# EasyEDA Pro project 鲲FOC无刷电机控制器.epro, board 驱动板
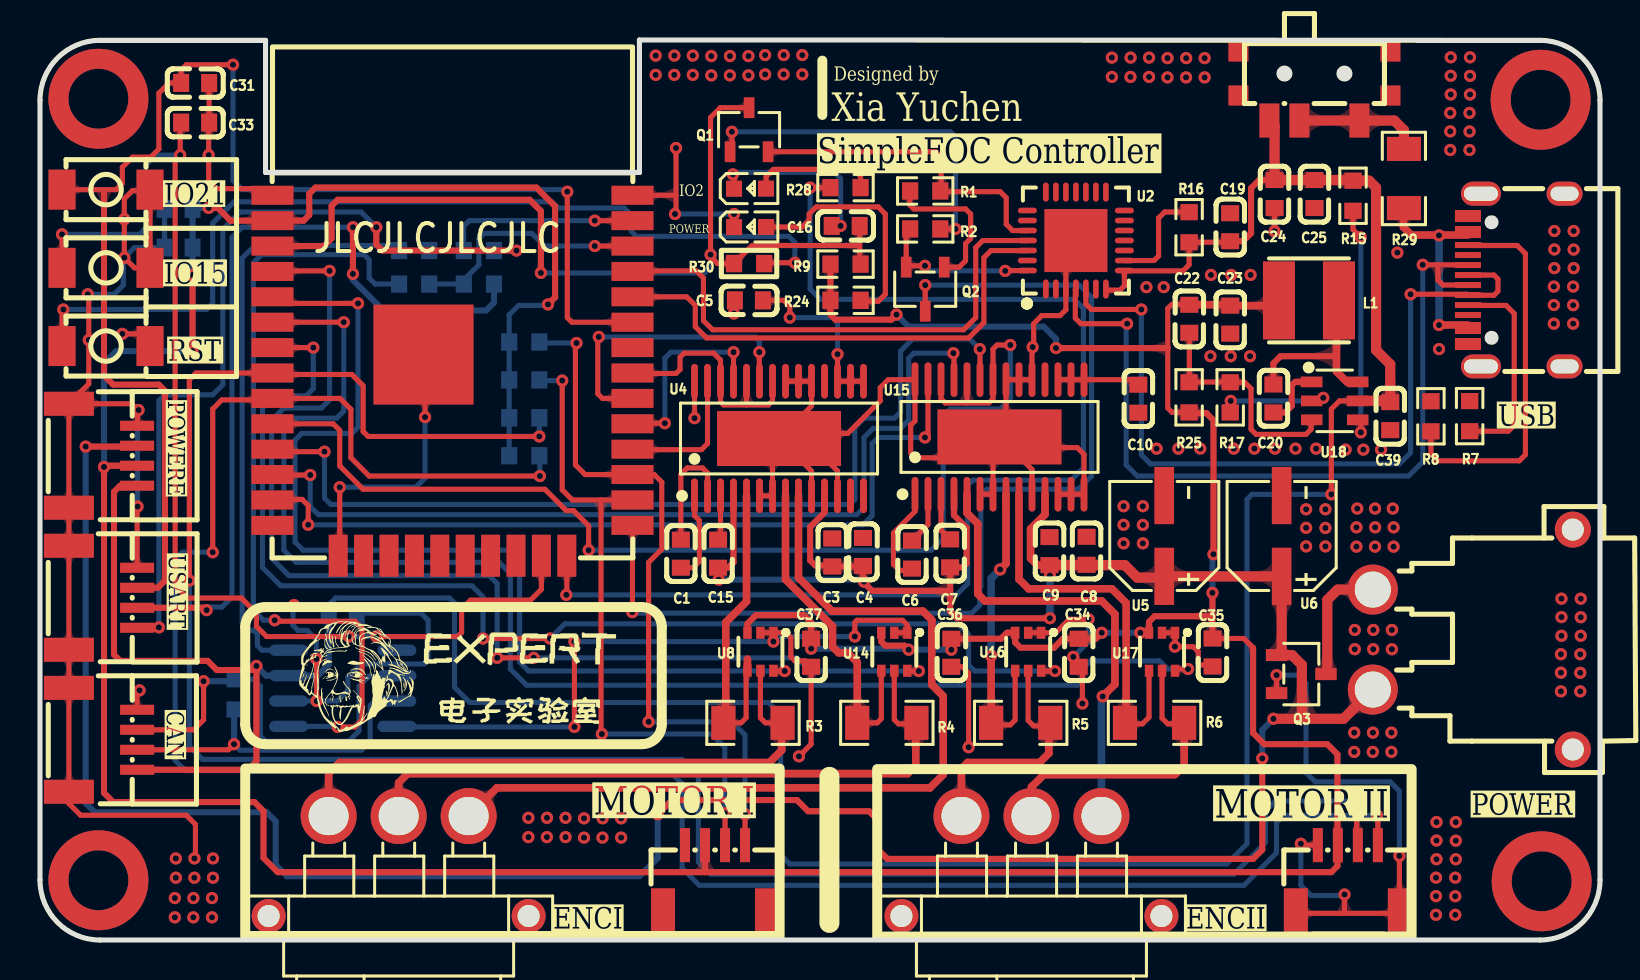
[diagram p2: board, top side]
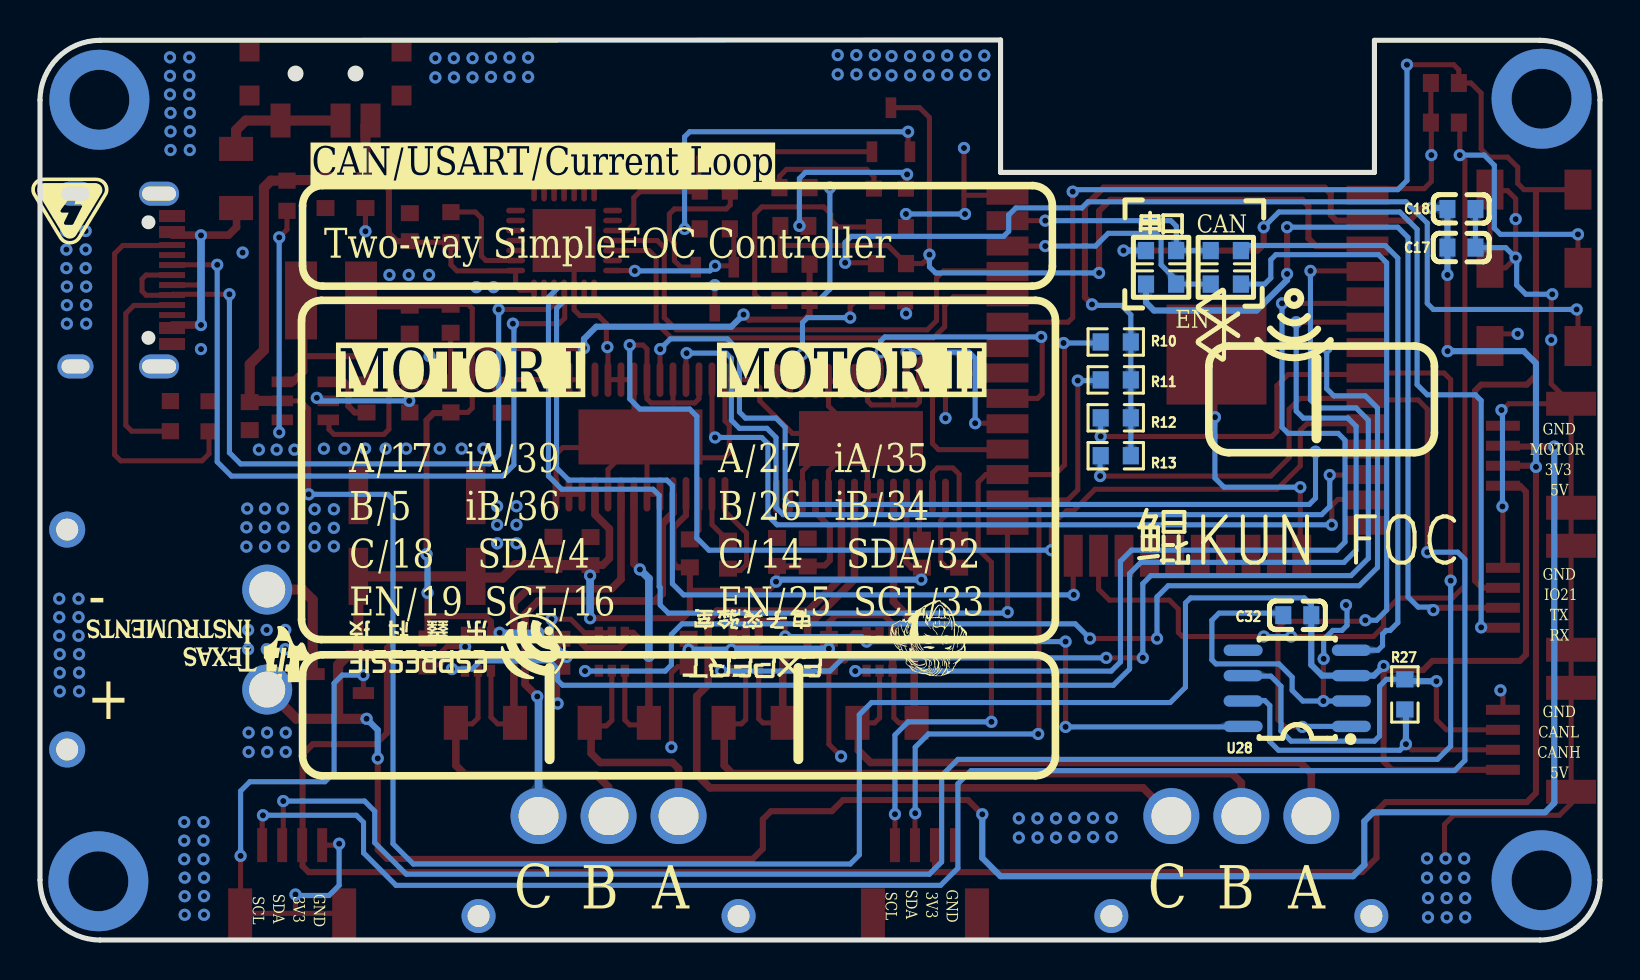
[diagram p3: board, bottom side, seen from below]

Outline 78 x 45.02 mm; copper layers: Top Layer, Bottom Layer. Coordinates in mm from the lower left corner of the outline.
Outline path: 0,42 arc(0.88,44.12) 3,45 11.28,45 11.28,38.39 29.97,38.39 29.97,45.02 75,45 arc(77.12,44.12) 78,42 78,3 arc(77.12,0.88) 75,0 3,0 arc(0.88,0.88) 0,3 0,42
Stack: Top Layer 0.035mm / Dielectric1 1.51mm FR4 er 4.5 / Bottom Layer 0.035mm

## Design rules (mm)
template: 自定义配置
spacing copperThickness1oz (default): track to track 0.102, other pairs 0 to 0.3
spacing copperThickness2oz: track to track 0.203, other pairs 0.152 to 0.3
track width copperThickness1oz (default): min 0.127, default 0.254, max 2.54
track width copperThickness2oz: min 0.203, default 0.254, max 2.54
differential pair differentialPair (default): width min 0.127, default 0.254, max 2.54; gap min 0.152, default 0.152
via viaSize (default): diameter min 0.5, default 0.61, max 10; hole min 0.3, default 0.305, max 6.3

## Placement (name value [footprint] x y rotation side)
C1  0.01UF  [C0603]  32.04 19.32 270 top
C3  10UF  [C0603]  39.61 19.38 90 top
C4  0.1UF  [C0603]  41.15 19.41 270 top
C5  0.1UF  [C0603]  35.45 32 180 top
C6  0.01UF  [C0603]  43.6 19.28 270 top
C7  0.1UF  [C0603]  45.51 19.34 270 top
C8  10UF  [C0603]  52.33 19.47 90 top
C9  0.1UF  [C0603]  50.47 19.45 270 top
C10  0.1UF  [C0603]  54.91 27.08 270 top
C15  0.1UF  [C0603]  33.91 19.32 270 top
C16  10UF  [C0603]  40.28 35.72 0 top
C17  0.01UF  [C0603]  6.93 34.63 180 bottom
C18  0.01UF  [C0603]  6.93 36.57 180 bottom
C19  0.1UF  [C0603]  59.51 35.65 270 top
C20  0.1uf  [C0603]  61.67 27.09 270 top
C22  47pf  [C0603]  57.47 31.07 90 top
C23  10uf  [C0603]  59.51 31.03 90 top
C24  10uf  [C0603]  61.73 37.31 90 top
C25  0.1uf  [C0603]  63.72 37.31 90 top
C31  0.1uf  [C0603]  7.76 42.87 180 top
C32  0.1UF  [C0603]  15.14 16.25 0 bottom
C33  0.1uf  [C0603]  7.76 40.89 180 top
C34  0.1uf  [C0603]  51.93 14.37 270 top
C35  0.1uf  [C0603]  58.63 14.38 90 top
C36  0.1uf  [C0603]  45.57 14.37 270 top
C37  0.1uf  [C0603]  38.56 14.37 270 top
C39  0.1uf  [C0603]  67.51 26.2 90 top
CN1  MR30PW-F  [CONN-TH_MR30PW-F]  17.93 3.7 0 top
CN2  MR30PW-F  [CONN-TH_MR30PW-F]  49.57 3.7 0 top
CN3  XT30PW-M  [CONN-TH_XT30PW-M]  71.64 15.03 90 top
L1  4.7uH  [IND-SMD_L4.0-W4.0_FNR40XXS]  63.45 31.99 180 top
LED1  -  [LED_0603]  35.55 35.67 0 top
LED2  -  [LED_0603]  35.55 37.59 0 top
Q1  S8050 J3Y  [SOT-23-3_L3.0-W1.7-P0.95-LS2.9-BR]  35.45 40.53 270 top
Q2  S8050 J3Y  [SOT-23-3_L3.0-W1.7-P0.95-LS2.9-BR]  44.26 32.55 90 top
Q3  AO3400A  [SOT-23-3_L2.9-W1.6-P1.90-LS2.8-BR]  63.06 13.3 180 top
R1  10K  [R0603]  44.26 37.47 180 top
R2  10K  [R0603]  44.26 35.57 0 top
R3  0.5  [R1206]  35.65 10.86 180 top
R4  0.5  [R1206]  42.34 10.86 180 top
R5  0.5  [R1206]  49.03 10.86 180 top
R6  0.5  [R1206]  55.73 10.86 180 top
R7  5.1K  [R0603]  71.48 26.2 90 top
R8  5.1K  [R0603]  69.55 26.2 90 top
R9  10K  [R0603]  40.28 33.81 0 top
R10  10K  [R0603]  24.21 29.91 0 bottom
R11  10K  [R0603]  24.21 28.02 0 bottom
R12  10K  [R0603]  24.21 26.12 0 bottom
R13  10K  [R0603]  24.21 24.22 0 bottom
R15  100K  [R0603]  65.65 37.23 90 top
R16  210K  [R0603]  57.46 35.65 90 top
R17  22.1k  [R0603]  59.51 27.14 90 top
R24  1K  [R0603]  40.28 32 180 top
R25  100K  [R0603]  57.46 27.14 270 top
R27  120  [R0603]  9.76 12.28 270 bottom
R28  10k  [R0603]  40.28 37.63 0 top
R29  0.5  [R1206]  68.19 38.09 90 top
R30  10  [R0603]  35.45 33.84 0 top
R31  opt(串口)  [R0603]  21.95 34.48 180 bottom
R32  opt（串口）  [R0603]  21.95 32.81 180 bottom
R33  opt(can)  [R0603]  18.71 34.48 180 bottom
R34  opt（can）  [R0603]  18.71 32.81 180 bottom
SW1  MK-12C01-G1.5  [SW-SMD_DEALON_MK-12C01-G1.5]  63.72 42.71 180 top
U1  ESP32-WROOM-32D  [WIFIM-SMD_ESP32-WROOM-32D]  20.62 28.24 270 top
U2  CP2102  [QFN-28_L5.0-W5.0-P0.50-TL-EP3.2]  51.79 34.99 90 top
U4  DRV8313PWPR  [HTSSOP-28_L9.8-W4.5-P0.65-LS6.6-BL-EP]  36.95 25.08 0 top
U5  47uF  [cap-smd_bd5.0-l5.3-w5.3-ls5.7-fd]  56.21 20.21 90 top
U6  47uF  [cap-smd_bd5.0-l5.3-w5.3-ls5.7-fd]  62.08 20.21 90 top
U8  INA199A1DCKR  [SC-70-6_L2.0-W1.3-P0.65-LS2.1-BR]  36.02 14.42 90 top
U11  TC-S3403-2.0-260G  [SW-SMD_L4.0-W3.0-LS5.0]  3.3 37.53 0 top
U14  INA199A1DCKR  [SC-70-6_L2.0-W1.3-P0.65-LS2.1-BR]  42.71 14.42 90 top
U15  DRV8313PWPR  [HTSSOP-28_L9.8-W4.5-P0.65-LS6.6-BL-EP]  47.98 25.16 0 top
U16  INA199A1DCKR  [SC-70-6_L2.0-W1.3-P0.65-LS2.1-BR]  49.41 14.42 90 top
U17  INA199A1DCKR  [SC-70-6_L2.0-W1.3-P0.65-LS2.1-BR]  56.1 14.42 90 top
U18  SY8120B  [SOT-23-6_L2.9-W1.6-P0.95-LS2.8-BL]  64.74 26.97 270 top
U20  SH1.0-4P  [CONN-SMD_4P-P1.00_SH1.0-4P]  33.75 3.04 0 top
U21  SH1.0-4P  [CONN-SMD_4P-P1.00_SH1.0-4P]  65.39 3.04 0 top
U22  SH1.0-4P  [CONN-SMD_4P-P1.00_SH1.0-4P]  3.15 17.12 270 top
U27  SH1.0-4P  [CONN-SMD_4P-P1.00_SH1.0-4P]  3.15 10.01 270 top
U28  TJA1050T/CM,118  [SOIC-8_L5.0-W4.0-P1.27-LS6.0-BL]  15.14 12.59 90 bottom
U29  SH1.0-4P  [CONN-SMD_4P-P1.00_SH1.0-4P]  3.15 24.22 270 top
U30  TC-S3403-2.0-260G  [SW-SMD_L4.0-W3.0-LS5.0]  3.3 33.62 0 top
U31  TC-S3403-2.0-260G  [SW-SMD_L4.0-W3.0-LS5.0]  3.3 29.71 0 top
USB1  HC-TYPE-C-16P-01B  [USB-C-SMD_KH-TYPE-C-16P]  73.81 33.01 90 top

## Footprints (pads in the part's own frame, mm; a bottom-side part is the same pattern mirrored in y, then rotated)
C0603
  rect 0.8x0.9 smd: 1(-0.7,0) 2(0.7,0)
cap-smd_bd5.0-l5.3-w5.3-ls5.7-fd
  rect 2.86x0.98 smd: 1(-2.02,0) 2(2.02,0)
CONN-SMD_4P-P1.00_SH1.0-4P
  rect 0.5x1.7 smd: 1(-1.5,1.705) 2(-0.5,1.705) 3(0.5,1.705) 4(1.5,1.705)
  rect 1.2x2.5 smd: 5(-2.6,-1.705) 6(2.6,-1.705)
CONN-TH_MR30PW-F
  round 2.8 hole 1.995x1.9: 1(-3.5,2.5) 2(0,2.5) 3(3.5,2.5)
  round 1.7 hole 1.1: 4(6.5,-2.5) 5(-6.5,-2.5)
CONN-TH_XT30PW-M
  round 2.5 hole 1.8: 1(-2.5,5) 2(2.5,5)
  round 1.8 hole 1.1: 3(5.5,-5) 4(-5.5,-5)
HTSSOP-28_L9.8-W4.5-P0.65-LS6.6-BL-EP
  oval 0.343x1.732 smd: 1(-4.225,-2.866) 2(-3.575,-2.866) 3(-2.925,-2.866) 4(-2.275,-2.866) 5(-1.625,-2.866) 6(-0.975,-2.866) 7(-0.325,-2.866) 8(0.325,-2.866) 9(0.975,-2.866) 10(1.625,-2.866) 11(2.275,-2.866) 12(2.925,-2.866) 13(3.575,-2.866) 14(4.225,-2.866) 15(4.225,2.866) 16(3.575,2.866) 17(2.925,2.866) 18(2.275,2.866) 19(1.625,2.866) 20(0.975,2.866) 21(0.325,2.866) 22(-0.325,2.866) 23(-0.975,2.866) 24(-1.625,2.866) 25(-2.275,2.866) 26(-2.925,2.866) 27(-3.575,2.866) 28(-4.225,2.866)
  rect 6.2x2.75 smd: 29(0,0)
IND-SMD_L4.0-W4.0_FNR40XXS
  rect 1.6x3.9 smd: 1(-1.5,0) 2(1.5,0)
LED_0603
  rect 0.8x0.8 smd: 1(-0.851,-0.01) 2(0.75,-0.005)
QFN-28_L5.0-W5.0-P0.50-TL-EP3.2
  oval 0.95x0.28 smd: 1(-2.425,1.502) 2(-2.425,1.001) 3(-2.425,0.5) 4(-2.425,0) 5(-2.425,-0.5) 6(-2.425,-1) 7(-2.425,-1.501) 15(2.425,-1.501) 16(2.425,-1) 17(2.425,-0.5) 18(2.425,0) 19(2.425,0.5) 20(2.425,1.001) 21(2.425,1.502)
  oval 0.28x0.95 smd: 8(-1.502,-2.425) 9(-1.001,-2.425) 10(-0.5,-2.425) 11(0,-2.425) 12(0.5,-2.425) 13(1,-2.425) 14(1.501,-2.425) 22(1.501,2.425) 23(1,2.425) 24(0.5,2.425) 25(0,2.425) 26(-0.5,2.425) 27(-1.001,2.425) 28(-1.502,2.425)
  rect 3.15x3.15 smd: 29(0,0)
R0603
  rect 0.806x0.864 smd: 1(-0.753,0) 2(0.753,0)
R1206
  rect 1.208x1.701 smd: 1(-1.479,0) 2(1.479,0)
SC-70-6_L2.0-W1.3-P0.65-LS2.1-BR
  rect 0.6x0.42 smd: 1(0.95,-0.65) 2(0.95,0) 3(0.95,0.65) 4(-0.95,0.65) 5(-0.95,0) 6(-0.95,-0.65)
SOIC-8_L5.0-W4.0-P1.27-LS6.0-BL
  oval 0.569x1.95 smd: 1(-1.905,-2.705) 2(-0.635,-2.705) 3(0.635,-2.705) 4(1.905,-2.705) 5(1.905,2.705) 6(0.635,2.705) 7(-0.635,2.705) 8(-1.905,2.705)
SOT-23-3_L2.9-W1.6-P1.90-LS2.8-BR
  rect 1.07x0.6 smd: 1(1.235,-0.95) 2(1.235,0.95) 3(-1.235,0)
SOT-23-3_L3.0-W1.7-P0.95-LS2.9-BR
  rect 1.038x0.532 smd: 1(1.101,-0.95) 2(1.101,0.95) 3(-1.101,0)
SOT-23-6_L2.9-W1.6-P0.95-LS2.8-BL
  rect 0.532x1.072 smd: 1(-0.95,-1.149) 2(0,-1.149) 3(0.95,-1.149) 4(0.95,1.149) 5(0,1.149) 6(-0.95,1.149)
SW-SMD_DEALON_MK-12C01-G1.5
  rect 1x1.7 smd: 1(2.25,1.725) 2(0.75,1.725) 3(-2.25,1.725)
  rect 1x1 smd: 4(-3.8,0.475) 4(-3.8,-1.725) 4(3.8,0.475) 4(3.8,-1.725)
SW-SMD_L4.0-W3.0-LS5.0
  rect 1.35x2 smd: 1(-2.2,0) 2(2.2,0)
USB-C-SMD_KH-TYPE-C-16P
  oval 1.2x2 hole 0.7x1.7: 1(-4.32,1.765) 2(4.32,1.765)
  oval 1.2x1.8 hole 0.7x1.4: 3(-4.32,-2.415) 4(4.32,-2.415)
  rect 0.3x1.3 smd: A1(-3.35,2.415) A4(-2.55,2.415) A5(-1.25,2.415) A6(-0.25,2.415) A7(0.25,2.415) A8(1.25,2.415) A9(2.55,2.415) A12(3.35,2.415) B1(3.05,2.415) B4(2.25,2.415) B5(1.75,2.415) B6(0.75,2.415) B7(-0.75,2.415) B8(-1.75,2.415) B9(-2.25,2.415) B12(-3.05,2.415)
WIFIM-SMD_ESP32-WROOM-32D
  rect 0.95x2.1 smd: 1(-9.015,-9) 2(-7.745,-9) 3(-6.475,-9) 4(-5.205,-9) 5(-3.935,-9) 6(-2.665,-9) 7(-1.395,-9) 8(-0.125,-9) 9(1.145,-9) 10(2.415,-9) 11(3.685,-9) 12(4.955,-9) 13(6.225,-9) 14(7.495,-9) 25(7.495,9) 26(6.225,9) 27(4.955,9) 28(3.685,9) 29(2.415,9) 30(1.145,9) 31(-0.125,9) 32(-1.395,9) 33(-2.665,9) 34(-3.935,9) 35(-5.205,9) 36(-6.475,9) 37(-7.745,9) 38(-9.015,9)
  rect 2.1x0.95 smd: 15(9.015,-5.715) 16(9.015,-4.445) 17(9.015,-3.175) 18(9.015,-1.905) 19(9.015,-0.635) 20(9.015,0.635) 21(9.015,1.905) 22(9.015,3.175) 23(9.015,4.445) 24(9.015,5.715)
  rect 5x5 smd: 39(-1.045,-1.45)

## Nets
As in the schematic.

Pads without a net: U1 14 16 17 18 19 20 21 22 32; U2 1 2 6 10 11 12 13 14 15 16 17 18 19 20 21 22 23 27; U4 18; U15 18; U28 5; USB1 A8 B8

## Via types
v1: diameter 5, hole 3, Top Layer to Bottom Layer, 4 vias
v2: diameter 0.61, hole 0.305, Top Layer to Bottom Layer, 298 vias

## Routing (per net, layer and track width the routed paths; a pad name or vN(x,y) marks a point on that pad's centre or on a via; arc(x,y) is an arc through that point)
GND: length 284.1
  Top Layer w0.254: v2(64.16,27.12) 64.01,26.97 U18.2 ; v2(37.95,9.19) 38.56,9.8 C37.2 38.26,13.96 37.74,13.96 37.54,14.16 37.54,15.13 37.3,15.37 U8.1 ; v2(52.12,11.83) 52.12,13.48 C34.2 51.93,13.89 v2(51.66,14.16) ; U21.1 63.12,4.74 v2(63.04,4.82) ; U15.6 U15.7 47.65,24.84 ; 34.7,35.66 v2(34.7,36.31) ; 8.46,42.87 8.46,40.89 8.43,40.86 v2(8.43,39.26) 8.43,37.94 8.79,37.58 11.29,37.58 U1.1 ; R17.1 59.54,26.42 v2(59.54,26.97) ; U17.2 U17.1 56.75,14.68 v2(56.74,14.67) 57.66,14.67 57.91,14.42 57.91,13.86 58.01,13.76 58.55,13.76 C35.1 ; U4.21 U4.20 U4.19 38.58,26.71 37.21,25.34 ; U1.39 19.25,29.2 v2(19.25,26.15) ; C16.1 v2(40.03,35.72) ; U15.29 48.3,25.49 U15.21 U15.20 U15.19 49.6,29.63 v2(49.63,29.66) 49.68,29.71 49.68,30.83 50.09,31.23 51,31.23 51.29,31.52 51.29,34.49 U2.29 ; U15.29 48.51,24.63 ; U15.29 47.65,24.84 ; U4.12 39.88,23.46 38.25,25.08 U4.29 ; v2(40.74,15.18) 40.74,15.89 40.84,15.99 43.13,15.99 43.36,15.76 U14.1 U14.2 ; 34.7,37.58 34.7,38.24 v2(34.65,38.29) ; U29.5 U22.5 U22.6 U27.5 U27.6 1.44,6.83 2.03,6.24 7.31,6.24 7.77,5.78 7.77,4.13 v2(7.72,4.08) ; U29.5 2.44,27.82 v2(2.44,30.01) 2.44,32.25 v2(2.39,32.3) ; U29.5 4.56,26.82 4.88,26.51 ; U4.29 37.21,25.34 ; U4.29 37.45,24.58 38.58,23.46 U4.10 ; U4.29 36.63,24.76 U4.7 U4.6 ; 31.8,37.25 U1.38 ; 31.8,37.25 v2(31.8,39.61) ; 31.8,37.25 31.8,36.36 v2(31.75,36.31) ; U8.2 U8.1 ; U8.1 v2(36.67,14.93) ; v2(4.93,26.51) 4.88,26.51 ; 4.88,26.51 4.88,25.75 U29.1 ; 37.21,25.34 40.39,25.34 42.01,26.97 42.01,27.63 42.41,28.03 U15.28 43.75,25.96 43.54,25.75 43.54,24.38 43.79,24.12 46.93,24.12 47.48,24.66 47.65,24.84 ; v2(26.72,14.93) v2(26.72,10.66) ; U22.1 4.85,21.66 v2(4.88,21.68) ; v2(46.43,9.64) 46.43,13.35 46.12,13.67 C36.2 ; U27.1 4.85,12.36 v2(4.98,12.49) ; C5.2 34.75,31.38 v2(34.7,31.33) ; v2(13.82,14.06) 13.83,14.05 v2(13.83,11.95) ; U15.12 U15.13 U15.14 52.2,24.3 51.87,24.63 48.51,24.63 ; 48.51,24.63 49.6,23.54 U15.10 ; U31.2 4.89,30.32 v2(4.11,30.32) ; v2(67.97,4.21) 67.97,1.36 U21.6 65.17,1.33 ; 65.17,1.33 U21.5 ; 65.17,1.33 65.23,1.4 v2(65.23,2.28) ; U1.15 14.99,19.3 v2(14.99,22.65) ; C24.1 v2(61.73,35.45) ; U4.28 v2(32.73,26.1) ; U16.2 U16.1 50.78,15.37 51.46,16.04 v2(52.43,16.04) ; Q3.2 v2(61.83,13.25) ; U11.2 5.45,37.48 4.62,37.48 4.22,37.08 v2(4.22,36.06) v2(4.22,34.13) 4.72,33.62 U30.2 U11.2
  Bottom Layer w0.254: C18.2 C17.2 4.72,34.63 v2(4.22,34.13) 4.17,34.08 4.17,32.76 3.71,32.3 v2(2.39,32.3) ; C32.2 15.94,16.35 19.05,16.35 19.41,15.99 19.41,14.01 19.2,13.81 16.05,13.81 15.39,13.15 15.39,12.49 14.86,11.95 v2(13.83,11.95) U28.2 ; v2(31.75,36.31) v2(34.7,36.31) ; v2(4.93,26.51) 4.88,26.46 v2(4.88,21.68) ; v2(19.25,26.15) 19.25,23.11 18.8,22.65 v2(14.99,22.65) ; v2(67.97,4.21) 67.97,7.45 67.51,7.92 63.75,7.92 63.3,8.37 63.3,12.84 62.89,13.25 v2(61.83,13.25) ; v2(13.82,14.06) 13.82,15.03 13.36,15.48 12.9,15.48 12.65,15.74 12.65,16.7 v2(12.7,16.75) ; v2(51.66,14.16) 52.43,14.93 v2(52.43,16.04) ; v2(64.16,27.12) 64.01,26.97 v2(59.54,26.97) 59.54,27.02 ; v2(40.03,35.72) 40.03,38.09 39.73,38.4 34.75,38.4 v2(34.65,38.29) ; v2(26.72,10.66) 17.87,10.66 U28.8 ; v2(26.72,14.93) v2(36.67,14.93) 36.93,15.18 v2(40.74,15.18) ; v2(65.23,2.28) 65.18,2.23 63.55,2.23 63.04,2.73 v2(63.04,4.82)
  vias: v2(6.74,2.1) v2(6.74,1.13) v2(6.79,4.08) v2(6.79,3.12) v2(7.72,3.12) v2(7.67,2.1) v2(7.67,1.13) v2(8.6,2.1) v2(8.6,1.13) v2(8.65,4.08) v2(8.65,3.12) v2(24.42,6.11) v2(24.42,5.15) v2(25.35,6.11) v2(25.34,5.15) v2(26.28,6.11) v2(26.28,5.15) v2(27.2,6.09) v2(27.2,5.12) v2(28.13,6.09) v2(28.12,5.12) v2(29.06,6.09) v2(29.06,5.12) v2(30.78,44.24) v2(30.78,43.27) v2(31.72,44.24) v2(31.71,43.27) v2(32.64,44.24) v2(32.64,43.27) v2(33.56,44.21) v2(33.56,43.25) v2(34.5,44.21) v2(34.49,43.25) v2(35.42,44.21) v2(35.42,43.25) v2(36.26,44.26) v2(36.26,43.3) v2(37.19,44.26) v2(37.18,43.3) v2(38.11,44.26) v2(38.11,43.3) v2(53.59,44.14) v2(53.59,43.17) v2(54.18,21.7) v2(54.18,20.77) v2(54.18,19.84) v2(54.53,44.14) v2(54.52,43.17) v2(55.14,21.7) v2(55.14,20.76) v2(55.14,19.84) v2(55.32,32.66) v2(55.45,44.14) v2(55.45,43.17) v2(55.83,24.58) v2(56.19,32.66) v2(56.37,44.11) v2(56.37,43.15) v2(56.92,24.58) v2(57.31,44.11) v2(57.3,43.15) v2(58.01,24.58) v2(58.23,44.11) v2(58.23,43.15) v2(58.55,33.27) v2(58.52,29.2) v2(59.54,29.2) v2(59.56,33.27) v2(59.69,24.58) v2(60.53,33.27) v2(60.5,29.2) v2(60.72,24.58) v2(61.75,24.58) v2(62.78,24.58) v2(63.31,21.54) v2(63.31,20.62) v2(63.31,19.69) v2(63.81,24.58) v2(64.27,21.54) v2(64.27,20.61) v2(64.27,19.69) v2(65.28,24.53) v2(65.74,15.51) v2(65.74,14.55) v2(65.71,10.37) v2(65.71,9.41) v2(65.82,20.64) v2(65.82,19.68) v2(65.86,21.58) v2(66.17,24.53) v2(66.65,10.37) v2(66.64,9.41) v2(66.67,15.51) v2(66.66,14.55) v2(66.75,21.58) v2(66.76,20.64) v2(66.75,19.68) v2(67.06,24.53) v2(67.64,21.58) v2(67.59,15.51) v2(67.59,14.55) v2(67.57,10.37) v2(67.57,9.41) v2(67.68,20.64) v2(67.68,19.68) v2(67.87,34.38) v2(69.82,5.9) v2(69.82,4.97) v2(69.82,4.04) v2(69.8,3.12) v2(69.8,2.2) v2(69.8,1.26) v2(69.95,29.56) v2(70.54,44.15) v2(70.54,43.23) v2(70.54,42.29) v2(70.51,41.37) v2(70.51,40.45) v2(70.51,39.51) v2(70.79,5.9) v2(70.79,4.97) v2(70.79,4.04) v2(70.76,3.12) v2(70.76,2.19) v2(70.76,1.26) v2(71.5,44.15) v2(71.5,43.22) v2(71.5,42.29) v2(71.48,41.37) v2(71.48,40.44) v2(71.48,39.51) v2(75.72,35.46) v2(75.72,34.54) v2(75.72,33.61) v2(75.69,32.68) v2(75.69,31.76) v2(75.69,30.83) v2(76.05,14.29) v2(76.05,13.37) v2(76.05,12.44) v2(76.07,17.07) v2(76.07,16.15) v2(76.07,15.22) v2(76.68,35.46) v2(76.68,34.53) v2(76.68,33.61) v2(76.66,32.68) v2(76.66,31.76) v2(76.66,30.83) v2(77.04,17.07) v2(77.04,16.15) v2(77.04,15.22) v2(77.01,14.29) v2(77.01,13.37) v2(77.01,12.44)
VCC-3V3: length 226.7
  Top Layer w0.254: C35.2 60.19,15.08 60.66,14.62 ; C22.2 57.45,31.79 56.59,31.79 56.39,31.59 56.39,26.61 56.61,26.39 R25.2
  Top Layer w0.305: v2(7.62,29.45) 7.63,29.46 v2(7.63,33.27) ; 33.25,3.39 64.57,3.39 64.87,3.7 64.87,4.72 U21.2 64.87,4.76 64.87,9.29 64.36,9.8 61.21,9.8 60.66,10.35 60.66,14.62 ; 33.25,3.39 U20.2 ; 33.25,3.39 11.89,3.39 11.18,4.11 11.18,6.44 10.72,6.9 3.66,6.9 3.2,7.36 v2(3.2,23.66) 3.2,23.72 3.19,23.72 U29.3 ; 35.37,15.37 35.37,15.82 35.8,16.25 38.2,16.25 38.56,15.89 C37.1 v2(38.56,14.57) ; 58.62,16.2 55.73,16.2 55.45,15.92 U17.3 v2(55.02,15.37) ; 58.62,16.2 v2(58.62,17.36) ; 58.62,16.2 58.62,15.09 C35.2 ; v2(53.09,15.37) 52.79,15.07 C34.1 51.14,15.07 50.7,14.62 49.02,14.62 48.76,14.89 U16.3 48.35,15.37 48.05,15.07 C36.1 v2(45.57,14.52) ; v2(42.82,31.28) 42.57,31.03 39.78,31.03 39.52,31.28 R24.2 R9.1 ; U14.3 42.06,14.92 42.27,14.72 43.23,14.72 v2(43.43,14.52) ; R25.2 57.49,26.36 58.32,26.36 58.67,26 v2(58.67,19.3) ; v2(50.8,29.61) 56.39,29.61 ; v2(8.43,36.62) 8.89,36.62 9.53,35.98 13.18,35.98 13.46,36.26 13.46,37.33 13.77,37.63 24.82,37.63 25.76,36.7 25.76,32.15 v2(25.4,31.79)
  Top Layer w0.381: L1.2 61.69,31.73 C23.2 59.47,31.77 C22.2
  Bottom Layer w0.254: R13.1 R12.1 R11.1 R10.1 23.46,31.27 23.93,31.74 25.35,31.74 v2(25.4,31.79)
  Bottom Layer w0.305: v2(45.57,14.52) v2(43.43,14.52) 43.38,14.57 v2(38.56,14.57) ; v2(58.67,19.3) 58.62,19.24 v2(58.62,17.36) ; v2(3.2,23.66) 3.2,28.85 3.81,29.45 v2(7.62,29.45) ; v2(7.63,33.27) C17.1 C18.1 7.68,36.62 v2(8.43,36.62) ; v2(50.8,29.61) 50.8,30.06 50.19,30.67 43.43,30.67 v2(42.82,31.28) ; v2(55.02,15.37) v2(53.09,15.37)
VCC-MOTOR: length 162.7
  Top Layer w0.305: 45.51,17.47 45.51,16.43 45.85,16.09 v2(50.5,16.09) ; 45.51,17.47 C7.2 46.13,18.64 46.33,18.84 46.33,20.62 45.7,21.25 U15.4 ; 45.51,17.47 41.6,17.47 41.15,17.92 ; v2(41.2,17.92) 41.15,17.92 ; 41.15,17.92 C4.2 41.12,18.68 C3.1 39.56,18.74 38.76,18.74 38.51,18.99 38.51,20.67 39.23,21.39 U4.11 ; U29.2 4.81,24.68 v2(2.29,24.68) ; v2(61.11,9.08) 61.11,4.51 60.66,4.06 42.37,4.06 41.86,4.56 41.86,6.04 41.45,6.44 38.41,6.44 37.85,7 31.6,7 v2(30.89,6.29) ; U4.4 34.68,18.89 34.41,18.62 C15.2 33.91,18.05 v2(33.93,18.03)
  Top Layer w0.381: U15.11 50.25,21.29 49.53,20.56 49.53,19.09 49.87,18.75 C9.2 50.47,18.25 v2(50.5,18.23)
  Top Layer w0.508: C9.2 52.31,18.75 ; 52.31,18.75 54.24,18.75 54.86,18.13 56.15,18.13 U5.1 U6.1 62.08,14.5 Q3.1 62.6,14.25 63.09,13.76 63.09,11.07 ; 52.31,18.75 C8.1 ; CN3.1 65.18,11.07 63.09,11.07 ; v2(61.67,11.07) 63.09,11.07
  Bottom Layer w0.305: v2(61.67,11.07) 61.11,10.51 v2(61.11,9.08) ; v2(2.29,24.68) 2.29,6.85 2.74,6.39 11.33,6.39 11.79,5.94 11.79,3.75 12.34,3.19 29.97,3.19 30.89,4.11 v2(30.89,6.29) ; v2(41.2,17.92) 41.1,18.03 v2(33.93,18.03)
  Bottom Layer w0.381: v2(50.5,16.09) v2(50.5,18.23)
(no net):
  vias: v1(2.92,42.08) v1(2.92,2.99) v1(75.03,42.03) v1(75.08,2.94)
BOOTMODE: length 52.2
  Top Layer w0.254: Q2.3 v2(44.26,32.76) ; v2(29.62,16.4) 29.62,16.41 U1.25
  Bottom Layer w0.254: v2(29.62,16.4) 29.67,16.35 46.58,16.35 46.99,16.75 46.99,17.64 47.04,17.67 47.04,22.24 47.35,22.55 51.92,22.55 52.58,23.21 52.58,32.15 51.97,32.76 v2(44.26,32.76)
CAN_RX: length 29.7
  Bottom Layer w0.254: 17.95,34.48 17.7,34.74 10.74,34.74 10.11,34.11 10.11,15.87 10.5,15.48 10.69,15.48 10.87,15.3 10.87,14.72 11.1,14.49 U28.4
CAN_TX: length 40.2
  Top Layer w0.254: v2(14.88,10.66) 15.75,10.66 16.1,11.02 16.1,15.59 15.75,15.94 11.79,15.94 v2(11.73,15.99)
  Bottom Layer w0.254: v2(14.88,10.66) 14.86,10.68 U28.1 ; 17.95,32.81 16.76,32.81 16.46,33.11 16.46,34.03 16.2,34.28 11.07,34.28 10.67,33.88 10.67,16.5 11.18,15.99 v2(11.73,15.99)
CANH: length 17.1
  Top Layer w0.254: U27.3 9.42,9.51 v2(9.7,9.8)
  Bottom Layer w0.254: v2(9.7,9.8) 10.01,9.49 16.07,9.49 16.51,9.93 16.51,11.73 16.76,11.98 17.82,11.98 U28.7
  Bottom Layer w0.305: R27.2 9.7,11.48 v2(9.7,9.8)
CANL: length 20.6
  Top Layer w0.254: U27.2 7.68,10.51 8.18,11.02 v2(8.18,12.94)
  Bottom Layer w0.254: U28.6 17.82,13.2 16.46,13.2 15.95,12.69 15.95,10.46 15.44,9.95 11.28,9.95 11.02,10.2 11.02,12.69 10.68,13.04 R27.1
  Bottom Layer w0.305: R27.1 9.66,12.94 v2(8.18,12.94)
CC1: length 10.4
  Top Layer w0.254: R7.1 73.41,25.45 73.71,25.75 73.71,31.33 73.3,31.74 71.42,31.74 71.4,31.76
CC2: length 19.2
  Top Layer w0.254: 71.4,34.76 71.42,34.74 73.86,34.74 74.27,34.33 74.27,24.27 73.97,23.97 69.9,23.97 69.55,24.32 R8.1
CP-RX: length 26.1
  Top Layer w0.254: U1.35 29.65,33.47 32.82,33.47 33.17,33.11 33.17,30.98 33.63,30.52 46.18,30.52 46.79,31.13 46.79,34.64 47.14,34.99 U2.25
CP-TX: length 24.9
  Top Layer w0.254: 49.37,34.48 47.55,34.48 47.19,34.13 47.19,30.88 46.43,30.12 33.32,30.12 32.77,30.67 32.77,31.74 32.34,32.17 U1.34
DN: length 39.4
  Top Layer w0.254: v2(68.53,32.3) 71.36,32.3 USB1.B7 71.41,32.25 72.69,32.25 72.9,32.45 72.9,33.06 72.7,33.26 USB1.A7 ; 52.29,32.56 52.29,31.81 52.57,31.54 v2(55.07,31.54)
  Bottom Layer w0.254: v2(55.07,31.54) 55.07,24.27 55.52,23.82 67.97,23.82 68.53,24.38 v2(68.53,32.3)
DP: length 41.1
  Top Layer w0.254: v2(69.14,33.77) 69.9,33.77 ; 69.9,33.77 71.39,33.77 71.4,33.76 ; 69.9,33.77 69.9,33.01 70.15,32.76 71.4,32.76 ; v2(54.36,30.83) 52.04,30.83 51.76,31.11 51.76,32.53 51.79,32.56
  Bottom Layer w0.254: v2(54.36,30.83) 54.31,30.78 54.31,23.77 54.86,23.21 68.43,23.21 69.14,23.92 v2(69.14,33.77)
DTR: length 8.2
  Top Layer w0.254: R2.1 43.31,35.37 Q2.2 43.38,33.72 v2(44.25,33.72) ; v2(48.26,33.47) 48.28,33.48 49.37,33.48
  Bottom Layer w0.254: v2(48.26,33.47) 44.5,33.47 v2(44.25,33.72)
ESPEN: length 46.9
  Top Layer w0.254: Q1.3 34.02,41.63 33.53,41.14 v2(33.53,34.28) 33.53,34.18 33.87,33.84 R30.1 35.6,34.74 40.98,34.74 ; 40.98,34.74 40.98,33.85 R9.2 ; 40.98,34.74 C16.2
  Top Layer w0.305: U1.3 14.2,34.71 14.58,35.09 14.58,36.72 14.88,37.02 24.49,37.02 25.04,36.47 v2(25.04,33.37)
  Bottom Layer w0.254: v2(25.04,33.37) 33.22,33.37 33.53,33.67 v2(33.53,34.28)
IO15: length 57.5
  Top Layer w0.254: U1.23 25.07,17.54 24.53,17 21.53,17 21.08,16.55 21.08,15.38 20.88,15.18 v2(16.81,15.18) ; v2(15.44,15.18) 11.33,15.18 10.82,15.69 10.82,16.35 10.06,17.1 7.38,17.1 6.76,17.72 6.76,39.01 v2(7.01,39.26) 7.01,40.84 C33.2 ; U30.1 v2(1.1,35.3)
  Bottom Layer w0.254: v2(1.1,35.3) 4.98,35.3 5.28,35.6 5.28,38.75 5.79,39.26 v2(7.01,39.26) ; v2(15.44,15.18) v2(16.81,15.18)
IO21: length 69.7
  Top Layer w0.254: 29.62,30.9 26.6,30.9 26.37,31.13 v2(26.37,37.43) ; v2(9.65,43.78) 7.31,43.78 7.06,43.53 7.06,42.87 C31.2 6.45,42.87 5.94,42.36 5.94,39.56 5.54,39.16 4.62,39.16 4.11,38.65 4.11,37.84 3.8,37.53 U11.1
  Top Layer w0.305: U22.2 5.89,17.62 6.25,17.97 6.25,27.47 5.94,27.78 3.66,27.78 3.2,28.24 3.2,37.51
  Bottom Layer w0.254: v2(9.65,43.78) 9.65,37.99 10.11,37.53 26.26,37.53 v2(26.37,37.43)
IO22: length 12.4
  Top Layer w0.254: U1.36 v2(27.74,34.71)
  Bottom Layer w0.254: v2(27.74,34.71) 25.22,34.71 24.59,35.35 22.2,35.35 21.95,35.09 21.95,33.77 21.19,33.02 R32.2 R34.1
IO23: length 11.5
  Top Layer w0.254: 29.62,35.98 v2(27.74,35.98)
  Bottom Layer w0.254: v2(27.74,35.98) 21.46,35.98 21.18,35.7 21.18,34.49 R31.2 R33.1
M1-EN: length 12.3
  Top Layer w0.254: U4.22 36.63,26.97 36.42,26.76 35.33,26.76 ; U1.31 29.65,28.34 31.8,28.34 32,28.54 32,29.15 32.21,29.35 33.68,29.35 34.03,29.01 U4.26 34.03,26.92 34.18,26.76 35.33,26.76 ; 35.33,26.76 U4.24
M1-I2C-SCL: length 35.5
  Top Layer w0.254: v2(30.43,10.91) 30.43,18.89 31.09,19.55 31.09,22.9 30.71,23.28 U1.27 27.26,23.28 26.77,23.77 26.77,29.81 v2(26.82,29.86) ; U20.4 v2(35.25,6.29)
  Bottom Layer w0.254: v2(35.25,6.29) 35.25,10.26 34.59,10.91 v2(30.43,10.91) ; R10.2 25.02,29.86 v2(26.82,29.86)
M1-I2C-SDA: length 33.4
  Top Layer w0.254: U20.3 34.25,6.33 v2(34.24,6.34) ; v2(26.11,27.98) 26.11,22.52 26.62,22.01 28.05,22.01 ; 28.05,22.01 U1.26 ; 28.05,22.01 28.05,10.34 v2(28.09,10.3)
  Bottom Layer w0.254: v2(34.24,6.34) 34.24,9.64 33.58,10.3 v2(28.09,10.3) ; R11.2 25,27.98 v2(26.11,27.98)
M1-ISENS-1: length 49.8
  Top Layer w0.254: v2(37.24,13.45) 36.69,13.45 U8.6 ; v2(15.9,31.84) 11.95,31.84 U1.5
  Bottom Layer w0.254: v2(15.9,31.84) 15.9,25.64 15.6,25.34 13.09,25.34 12.75,25 12.75,19.91 13.16,19.5 23.42,19.5 23.98,18.94 23.98,13.91 24.44,13.45 v2(37.24,13.45)
M1-ISENS-2: length 57
  Top Layer w0.254: v2(14.48,33.47) 11.65,33.47 U1.4 ; U14.6 43.38,13.45 v2(43.94,13.45) ; v2(24.69,14.11) v2(22.86,14.11)
  Bottom Layer w0.254: v2(24.69,14.11) 37.85,14.11 38.51,13.45 v2(43.94,13.45) ; v2(22.86,14.11) 22.86,17.82 22.45,18.23 12.45,18.23 11.58,19.09 11.58,26 12.19,26.61 14.07,26.61 14.48,27.02 v2(14.48,33.47)
M1-PORT-1: length 30.2
  Top Layer w0.254: U8.5 36.02,11.11 36.27,10.86 R3.1
  Top Layer w0.381: CN1.1 14.43,8.33 14.99,8.88 36.47,8.88 37.08,9.49 37.08,10.82 R3.1
M1-PORT-2: length 33.6
  Top Layer w0.254: U14.5 42.71,11.02 42.93,10.81 43.77,10.81 43.79,10.83
  Top Layer w0.381: CN1.2 17.93,7.86 18.39,8.32 43.38,8.32 43.79,8.73 43.79,10.83 43.82,10.86
M1-PORT-3: length 44.2
  Top Layer w0.381: U4.9 37.93,18.13 39.6,16.45 44.15,16.45 44.59,16.01 44.59,12.77 45.16,12.2 45.16,8.27 44.5,7.61 22.84,7.61 CN1.3
M1-PWM-1: length 7
  Top Layer w0.254: U1.28 29.65,24.53 33.07,24.53 33.38,24.83 U4.27
M1-PWM-2: length 9.9
  Top Layer w0.254: U1.29 29.65,25.85 v2(31.24,25.85) ; U4.25 v2(34.68,29.4)
  Bottom Layer w0.254: v2(34.68,29.4) 31.55,29.4 31.24,29.1 v2(31.24,25.85)
M1-PWM-3: length 14.8
  Top Layer w0.254: v2(35.97,29.4) 35.97,27.96 U4.23 ; U1.30 28.12,27.09 27.89,27.32 27.89,30.12 v2(27.94,30.17)
  Bottom Layer w0.254: v2(35.97,29.4) 35.97,29.96 35.76,30.17 v2(27.94,30.17)
M2-EN: length 59
  Top Layer w0.254: 46.31,26.86 47.45,26.86 47.65,27.07 U15.22 47.65,29.56 47.85,29.76 v2(48.51,29.76) ; 46.31,26.86 45.26,26.86 45.05,27.08 U15.26 ; 46.31,26.86 46.35,26.9 U15.24 ; v2(27.43,19.5) 27.43,20.72 26.67,21.48 26.31,21.48 25.24,22.55 16.15,22.55 14.99,23.72 14.99,25.49 14.66,25.82 U1.10
  Bottom Layer w0.254: v2(48.51,29.76) 48.51,27.07 48.01,26.56 45.52,26.56 45.16,26.2 45.16,20.11 44.55,19.5 v2(27.43,19.5)
M2-I2C-SCL: length 108.9
  Top Layer w0.254: U21.4 66.89,6.2 v2(66.85,6.24) ; v2(8.64,19.4) 8.64,26.56 9.09,27.02 11.55,27.02 U1.9 15,27.09 15.55,26.55 15.55,24.12 16.46,23.21 v2(24.99,23.21)
  Bottom Layer w0.254: v2(24.99,23.21) 24.99,24.19 R13.2 ; v2(66.85,6.24) 62.18,6.24 61.82,5.88 61.82,4.36 60.2,2.73 32.97,2.73 32.11,3.6 32.11,7.81 31.44,8.47 7.26,8.47 6.76,8.98 6.76,19.04 7.11,19.4 v2(8.64,19.4)
M2-I2C-SDA: length 107.8
  Top Layer w0.254: v2(24.97,25.19) 16.41,25.19 16.15,25.44 16.15,27.73 15.6,28.29 11.7,28.29 U1.8 7.8,28.36 7.47,28.03 v2(7.47,17.97) ; v2(65.84,6.95) 65.84,4.8 U21.3
  Bottom Layer w0.254: R12.2 v2(24.97,25.19) ; v2(65.84,6.95) 61.77,6.95 61.26,6.44 61.26,4.87 59.69,3.29 33.53,3.29 32.92,3.9 32.92,8.22 32.11,9.03 8.13,9.03 7.47,9.69 v2(7.47,17.97)
M2-ISENS-1: length 60.5
  Top Layer w0.254: v2(50.75,13.45) 50.07,13.45 U16.6 ; U1.7 v2(13.67,29.63) ; v2(25.5,15.08) v2(22.15,15.08)
  Bottom Layer w0.254: v2(13.67,29.63) 13.67,27.58 13.31,27.22 11.73,27.22 11.12,26.61 11.12,18.64 12.04,17.72 21.59,17.72 22.15,17.16 v2(22.15,15.08) ; 50.89,13.45 46.74,13.45 46.43,13.76 46.43,15.28 45.9,15.81 26.24,15.81 v2(25.5,15.08) ; 50.89,13.45 50.87,13.44 50.73,13.44 ; 50.89,13.45 50.9,13.47
M2-ISENS-2: length 70.2
  Top Layer w0.254: 11.62,30.9 v2(15.19,30.9) ; v2(57.4,13.56) 56.84,13.56 U17.6
  Bottom Layer w0.254: v2(15.19,30.9) 15.19,26.46 14.83,26.1 12.6,26.1 12.19,25.7 12.19,19.5 12.8,18.89 22.96,18.89 23.52,18.33 23.52,13.56 24.33,12.74 51.87,12.74 52.12,13 52.12,13.56 52.53,13.96 55.98,13.96 56.39,13.56 v2(57.4,13.56) 57.46,13.61 57.56,13.61
M2-PORT-1: length 12.3
  Top Layer w0.254: U16.5 49.41,10.98 49.68,10.71 50.36,10.71 50.44,10.79
  Top Layer w0.381: R5.1 50.44,10.79 50.44,9.34 49.99,8.88 46.38,8.88 46.07,8.57 CN2.1
M2-PORT-2: length 15.3
  Top Layer w0.254: R6.1 57.16,10.81 56.39,10.81 56.1,11.1 U17.5
  Top Layer w0.381: CN2.2 49.57,7.65 50.19,8.27 56.74,8.27 57.21,8.73 R6.1
M2-PORT-3: length 22.9
  Top Layer w0.381: v2(53.14,12.18) 53.75,12.79 53.75,16.3 53.09,16.96 47.24,16.96 46.89,17.31 46.89,20.82 46.35,21.36 U15.5
  Bottom Layer w0.381: v2(53.14,12.18) 53.07,12.12 CN2.3
M2-PWM-1: length 40.6
  Top Layer w0.254: v2(44.25,25.14) 44.4,25.29 U15.27 ; v2(13.41,20.77) 13.41,21.73 13.11,22.04 11.65,22.04 U1.13
  Bottom Layer w0.254: v2(44.25,25.14) 41.91,25.14 41.6,24.83 41.6,21.23 41.15,20.77 v2(13.41,20.77)
M2-PWM-2: length 44.3
  Top Layer w0.254: v2(13.51,23.26) 11.65,23.26 U1.12 ; v2(45.67,29.35) 45.7,29.32 U15.25
  Bottom Layer w0.254: v2(13.51,23.26) 13.51,21.68 13.92,21.28 40.84,21.28 41.2,21.63 41.2,25.14 41.66,25.59 43.03,25.59 43.43,26 43.43,29.1 43.69,29.35 v2(45.67,29.35)
M2-PWM-3: length 46.9
  Top Layer w0.254: v2(46.99,29.56) 47,29.55 U15.23 ; U1.11 11.75,24.43 v2(14.22,24.43)
  Bottom Layer w0.254: v2(46.99,29.56) 46.48,30.06 43.64,30.06 43.03,29.45 43.03,26.41 42.72,26.1 41.2,26.1 40.74,25.64 40.74,22.04 40.49,21.78 14.54,21.78 14.22,22.1 v2(14.22,24.43)
RTS: length 16.4
  Top Layer w0.254: 49.37,35.49 48.63,35.49 48.31,35.81 48.31,37.13 48.01,37.43 45.05,37.43 R1.1 45.06,37.51 45.06,39.16 44.79,39.43 Q1.2
SERIAL1-RX: length 41.2
  Top Layer w0.305: U22.4 5.92,15.62 v2(5.94,15.64) ; v2(16.81,35.65) 16.81,34.79 17.12,34.48 v2(23.82,34.48)
  Bottom Layer w0.254: v2(16.81,35.65) 16.05,36.42 10.01,36.42 9.14,35.55 9.14,27.78 8.64,27.27 6.23,27.27 5.94,26.99 v2(5.94,15.64)
  Bottom Layer w0.305: R31.1 v2(23.82,34.48)
SERIAL1-TX: length 40.7
  Top Layer w0.305: v2(15.65,35.65) v2(15.65,33.32) ; U22.3 8.21,16.62 v2(8.33,16.5)
  Bottom Layer w0.254: v2(15.65,35.65) 10.11,35.65 9.6,35.14 9.6,17.16 9.09,16.65 8.48,16.65 v2(8.33,16.5)
  Bottom Layer w0.305: v2(15.65,33.32) 15.65,33.01 17.17,31.49 22.3,31.49 22.7,31.89 R32.1
USB-VCC: length 154.9
  Top Layer w0.254: v2(64.57,22.29) 64.57,26.56 64.97,26.97 65.88,26.97 ; C19.2 59.45,34.9 R16.1 57.46,33.77 57.15,33.47 54.24,33.47 ; 54.22,33.48 54.22,32.72 54,32.5 53.35,32.5 53.3,32.56
  Top Layer w0.305: C19.2 60.16,34.95 60.55,35.35 60.55,37.61 60.96,38.01 C24.2 ; U29.4 4,22.72 3.7,22.42 3.7,14.27 4.01,13.96 8.38,13.96 8.84,13.5 10.62,13.5 v2(10.82,13.71) 10.82,8.93 10.4,8.51 U27.4
  Top Layer w0.508: U18.5 67.45,26.97 C39.2 67.51,28.8 66.8,29.51 66.8,37.63 66.46,37.98 65.65,37.98 65.62,38.01 C25.2 C24.2 61.73,40.73 SW1.1
  Bottom Layer w0.254: v2(64.57,22.29) 60.6,22.29 60.35,22.04 60.35,4.82 59.33,3.8 37.49,3.8 37.03,4.26 37.03,11.27 36.42,11.88 21.49,11.88 20.73,12.64 20.73,16.86 20.47,17.11 14.78,17.11 14.44,16.76 C32.1
  Bottom Layer w0.305: v2(10.82,13.71) 11.3,13.22 U28.3 13.89,13.22 14.44,13.77 C32.1
USB-VCC-IN: length 10.3
  Top Layer w0.381: 69.95,35.26 69.95,35.26 USB1.B4 ; 69.95,35.26 68.57,35.26 68.17,35.65 68.17,36.59 R29.1 ; 69.95,35.26 v2(69.95,35.25) ; 71.4,30.76 v2(69.95,30.76)
  Bottom Layer w0.381: v2(69.95,30.76) v2(69.95,35.25)
$1N2980: length 4.4
  Top Layer w0.254: U4.1 32.73,21.22 32.97,20.98 32.97,18.94 32.65,18.62 C1.2
$1N3181: length 8.7
  Top Layer w0.254: C5.1 37.19,32 37.49,31.69 v2(37.49,31.13) ; U4.15 U4.16 U4.17 v2(39.88,29.3)
  Bottom Layer w0.254: v2(39.88,29.3) 39.88,30.88 39.62,31.13 v2(37.49,31.13)
$1N4042: length 2.7
  Top Layer w0.254: C6.1 44.4,20.78 U15.2
$1N4045: length 5
  Top Layer w0.254: U15.1 43.75,21.44 42.67,20.36 42.67,18.79 42.98,18.48 43.51,18.48 C6.2
$1N4048: length 2.4
  Top Layer w0.254: C7.1 45.05,20.5 U15.3
$1N4078: length 4.1
  Top Layer w0.254: C10.1 54.66,28.03 U15.15 U15.16 U15.17
$1N4426: length 2.2
  Top Layer w0.254: U4.3 34.03,20.14 C15.1
$1N4427: length 6
  Top Layer w0.254: U4.2 33.38,23.36 33.12,23.61 32.36,23.61 32.04,23.3 C1.1
$1N4623: length 17.7
  Top Layer w0.254: Q1.1 34.59,39.52 v2(34.59,40.43) ; R2.2 v2(45.77,35.57)
  Bottom Layer w0.254: v2(45.77,35.57) 45.77,40.17 45.52,40.43 v2(34.59,40.43)
$1N6446: length 5.4
  Top Layer w0.254: U2.9 55.7,33.99 55.93,34.22 55.93,36.11 56.24,36.42 57.45,36.42 R16.2
$1N8080: length 9.3
  Top Layer w0.305: 64.82,29.12 64.74,29.2 62.03,29.2 61.67,28.85 C20.1
  Top Layer w0.381: U18.6 65.34,27.92 64.82,28.44 64.82,31.86 64.95,31.99
$1N8081: length 3.2
  Top Layer w0.305: U18.1 62.76,27.92 62.59,27.74 62.59,26.71 62.26,26.39 C20.2
$1N8085: length 11.9
  Top Layer w0.254: U18.4 66.04,25.86 v2(66.04,25.39) ; v2(66.04,35.14) 65.65,35.53 R15.1
  Bottom Layer w0.254: v2(66.04,35.14) v2(66.04,25.39)
$1N8086: length 11.4
  Top Layer w0.254: U18.3 63.55,25.98 63.55,25.54 63.3,25.29 60.81,25.29 60.55,25.54 60.55,27.58 60.23,27.9 R17.2 59.5,27.91 57.47,27.91 ; 57.47,27.91 C22.1 ; 57.47,27.91 R25.1
$1N8089: length 12.1
  Top Layer w0.254: LED1.2 38.11,35.66 38.46,36.01 38.46,36.31 38.81,36.67 41.91,36.67 42.27,36.31 42.27,32.3 41.91,31.94 41.08,31.94 R24.1
$1N8297: length 6.2
  Top Layer w0.508: CN3.2 64.88,17.53 64.36,17.01 64.36,13.36 Q3.3
$1N11309: length 61.5
  Top Layer w0.254: v2(26.31,17.26) 26.34,17.29 U1.24 ; v2(38.51,37.63) R28.1
  Bottom Layer w0.254: v2(38.51,37.63) 38.51,32.55 39.01,32.05 51.71,32.05 52.17,31.59 52.17,23.61 51.56,23 46.65,23 46.38,22.73 46.38,17.82 45.82,17.26 v2(26.31,17.26)
$1N11631: length 6.4
  Top Layer w0.508: R29.2 68.19,40.51 67.72,40.99 65.97,40.99 SW1.3 SW1.2
$1N13545: length 46.9
  Top Layer w0.254: v2(37.74,33.88) 36.25,33.88 36.21,33.84 ; v2(1.17,31.54) 1.1,31.47 U31.1
  Bottom Layer w0.254: v2(37.74,33.88) 37.74,34.89 37.44,35.2 29.82,35.2 29.57,35.45 29.57,36.26 29.21,36.62 25.91,36.62 25.6,36.92 9.7,36.92 8.64,35.86 8.64,31.84 8.33,31.54 v2(1.17,31.54)
$1N13626: length 6.2
  Top Layer w0.254: LED2.2 36.3,38.18 36.67,38.55 40.67,38.55 41.03,38.19 R28.2
$1N21768: length 7.6
  Top Layer w0.254: R1.2 43.49,37.44 43.49,36.77 43.69,36.57 46.28,36.57 46.53,36.31 46.53,35.09 46.28,34.84 46.28,33.98 45.96,33.66 Q2.1
$1N28692: length 15.6
  Top Layer w0.254: R5.2 47.66,10.76 48.51,10.76 48.76,11 U16.4
  Top Layer w0.381: R5.2 v2(47.56,14.22) ; U15.8 48.3,18.83 v2(48.01,18.53)
  Bottom Layer w0.381: v2(47.56,14.22) 47.56,18.08 v2(48.01,18.53)
$1N28778: length 19.8
  Top Layer w0.254: U17.4 55.45,11.14 55.12,10.81 54.3,10.81 R6.2
  Top Layer w0.381: R6.2 54.31,10.92 54.31,16.86 53.59,17.57 49.43,17.57 48.95,18.05 U15.9
$1N28818: length 16
  Top Layer w0.254: 35.37,13.47 35.31,13.4 35.31,11.12 35.05,10.86 34.17,10.86
  Top Layer w0.381: 35.37,14.05 35.37,13.47 ; U4.5 35.33,16.93 34.29,15.89 34.29,10.98 34.17,10.86
$1N28837: length 16.8
  Top Layer w0.254: U14.4 42.06,11.07 41.86,10.86 R4.2
  Top Layer w0.381: R4.2 40.86,13.89 40.39,14.37 39.93,14.37 39.62,14.67 39.62,15.69 37.28,18.04 U4.8

## Copper pours and planes (outline as drawn; the poured copper is in the pictures)
GND on Top Layer: -1.27,45.51 79.6,45.51 79.6,-1.79 -1.27,-1.79
GND on Bottom Layer: -2.18,45.86 80.52,45.86 80.52,-3.01 -2.18,-3.01

Small or netless copper shapes (teardrops, artwork), in the pictures only: 518 on Top Layer, 176 on Bottom Layer

## Text on the board
Bottom Silkscreen Layer: GND | 3V3 | SDA | SCL | 5V | CANH | TX | RX | CANL | MOTOR | IO21 | CAN | EN | 串口 | CAN/USART/Current Loop | A/27   iA/35 / B/26   iB/34 / C/14    SDA/32 / EN/25  SCL/33 | A/17   iA/39 / B/5     iB/36 / C/18    SDA/4 / EN/19  SCL/16 | Two-way SimpleFOC Controller | A | B | C | MOTOR II | MOTOR I | 鲲KUN FOC | - | +
Top Silkscreen Layer: JLCJLCJLCJLC | POWER | IO2 | Designed by | CAN | POWERE | USART | IO21 | ENCI | ENCII | USB | IO15 | RST | SimpleFOC Controller | MOTOR I | MOTOR II | Xia Yuchen
